# EAGLE design shoulderbutton (EAGLE 9.1.0)
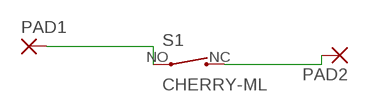
[diagram p0: schematic, sheet 1]

## Parts
PAD1  2,15/1,0  [2,15/1,0]
PAD2  2,15/1,0  [2,15/1,0]
S1  CHERRY-ML  [CHERRY-ML]

## Nets
N$1: PAD1.1(P) S1.NO
N$2: PAD2.1(P) S1.NC

## Library data of the parts
PAD1 PAD2 = wirepad:2,15/1,0: THROUGH-HOLE PAD
S1 = wiip:CHERRY-ML

## Board
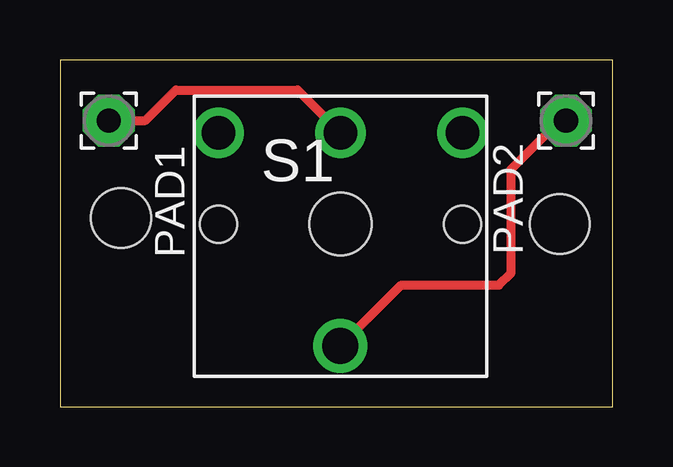
[diagram p1: board, top side]

Size 23.04 x 14.47 mm. Coordinates in mm from the lower left corner, seen from the top.
Outline: 0,0 23.04,0 23.04,14.47 0,14.47 0,0
Copper layers (1*16): Top 0.035mm / dielectric 1.5mm / Bottom 0.035mm
Design rules "oshpark": minimum track width 7mil, minimum drill 10mil, track to track 7mil, track to pad 7mil, pad to pad 7mil, via to via 7mil, smd to smd 6mil, copper to edge 10mil, drill to drill 6mil, minimum pad ring 10mil, minimum via ring 10mil, stop-mask expansion 2mil, vias tented up to drill 0mil, thermal gap 10mil
Holes 2.49 mm at 20.83,7.62 2.54,7.87

### Footprints (pad centres in the part's own frame; a part is rotated, then mirrored left to right if it is on the bottom)
2,15/1,0 = drill 1.016 pad 2.159 octagon: 1 0,0
CHERRY-ML = drill 1.5: NC 0,-5.08 | drill 1.4: NO 0,3.81; P$1 -5.08,3.81; P$2 5.08,3.81 | hole 1.55: -5.08,0; 5.08,0 | hole 2.6: 0,0

### Placement (x,y rotation side)
PAD1  2.03,11.94 0 top
PAD2  21.08,11.94 0 top
S1  11.68,7.62 0 top

### Tracks (layer width: path | path; a pad name or v marks a point on that pad's centre or on a via)
N$1
  Top 0.381: PAD1.1 3.56,11.94 4.83,13.21 9.91,13.21 S1.NO
N$2
  Top 0.381: S1.NC 14.22,5.08 18.29,5.08 18.8,5.59 18.8,9.91 20.83,11.94 PAD2.1